# EAGLE design 220_nfc (EAGLE 9.6.2)
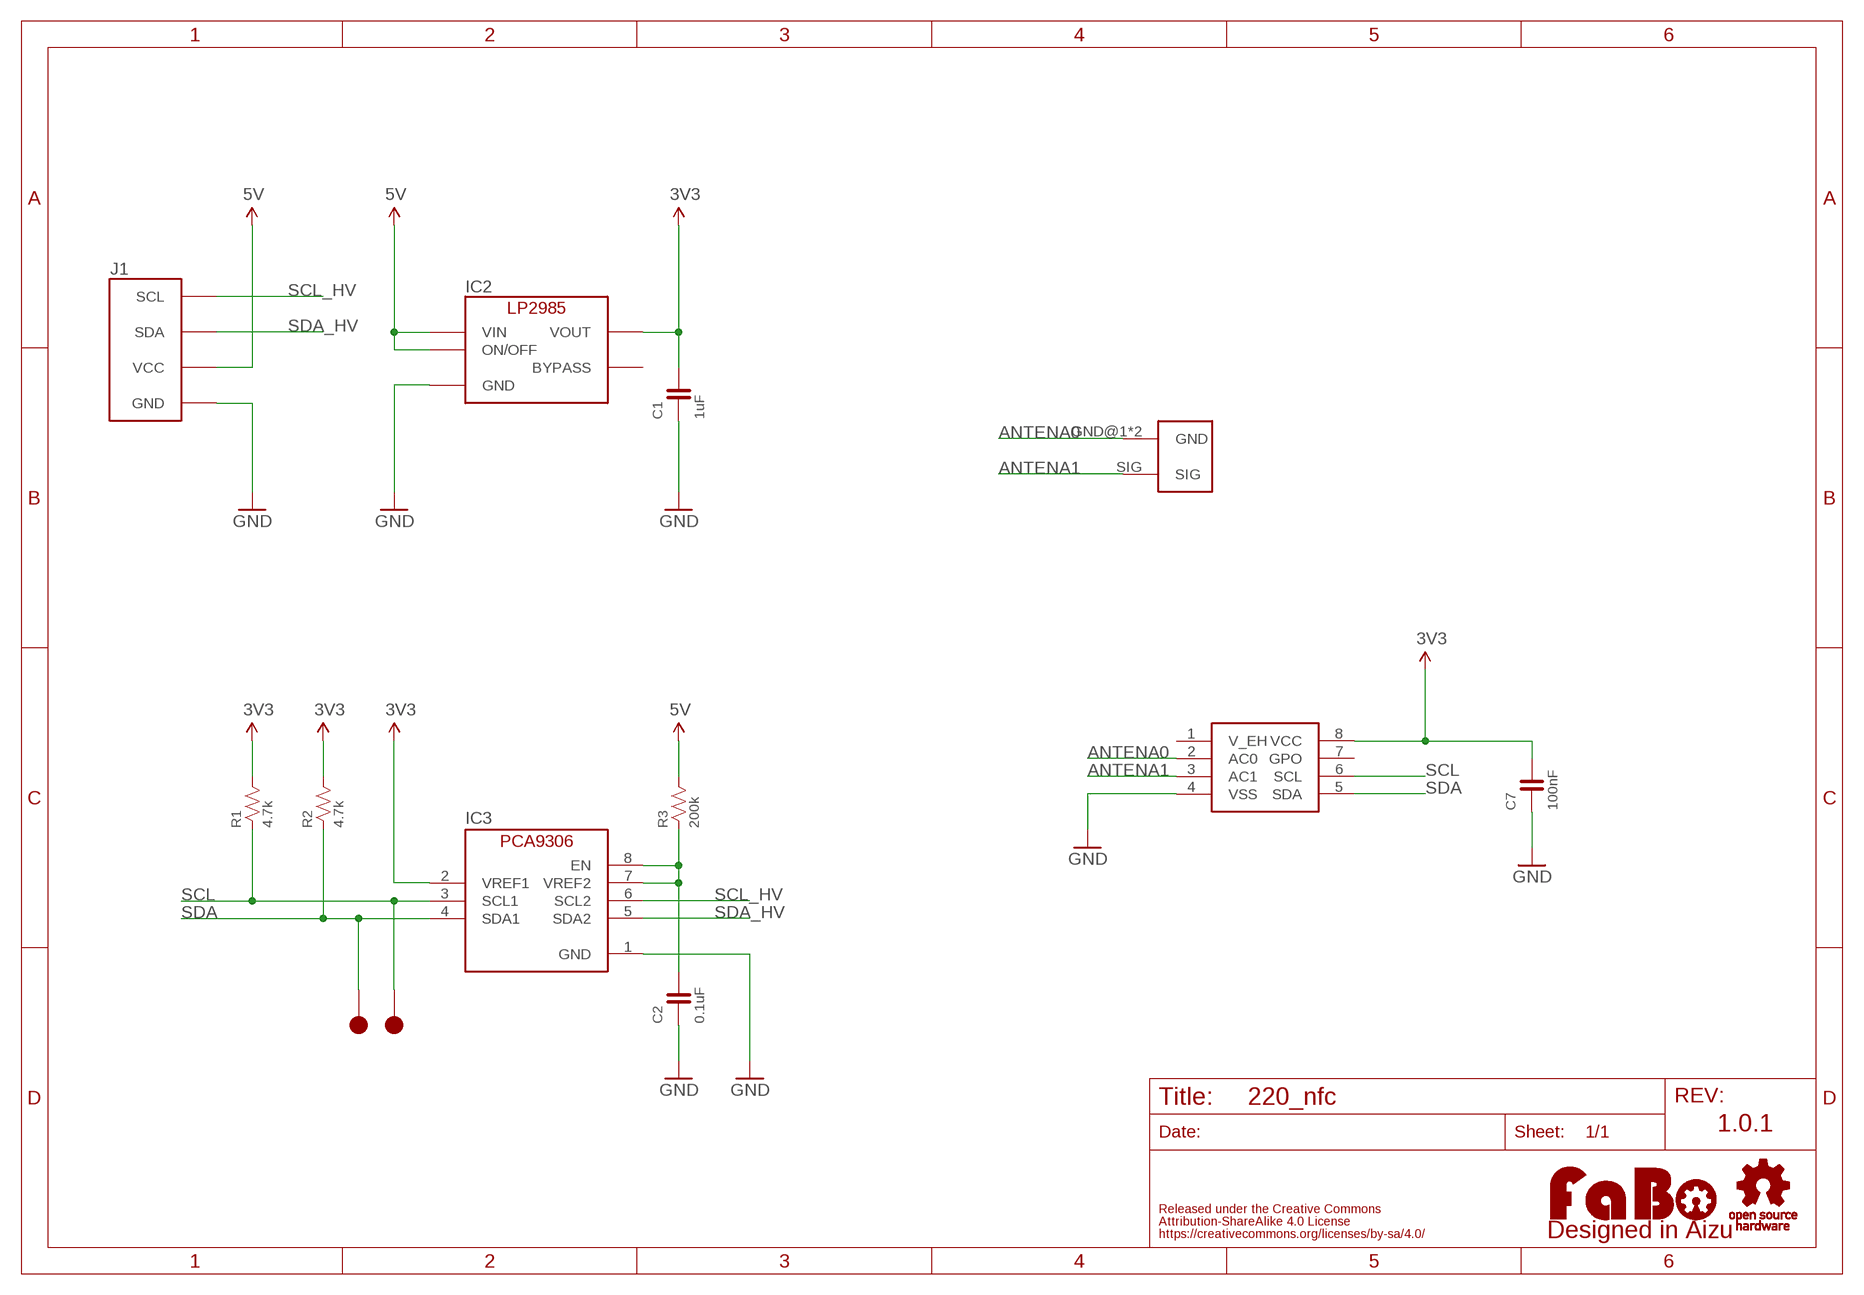
[diagram p0: schematic, sheet 1]

## Parts
C1  1uF  CAPACITOR-0603  [0603]
C2  0.1uF  CAPACITOR-0603  [0603]
C7  100nF  CAPACITOR-0603  [0603]
IC2  LP2985-33DBV  [SOT-23-5]
IC3  PCA9306GM  [XQFN8]
J1  FABO_BRICK_I2C  [FABO_BRICK_I2C]
LOGO1  LOGO_FABO-M  [LOGO_FABO_M]
R1  4.7k  RESISTOR-0603  [0603]
R2  4.7k  RESISTOR-0603  [0603]
R3  200k  RESISTOR-0603  [0603]
TP1  TP-15  [TP-15]
TP2  TP-15  [TP-15]
U$2  LOGO_OSHW-M_BOTTOM  [LOGO_OSHW_M_BOTTOM]
U$4  ST-ST25DV64K  [SO-8]
UF1  HIROSE-U.FL  [HIROSE-UF.L]

## Nets
3V3: C1.2 C7.2 IC2.5(VOUT) IC3.2(VREF1) R1.2 R2.2 U$4.8(VCC)
5V: IC2.1(VIN) IC2.3(ON/OFF) J1.VCC R3.2
ANTENA0: U$4.2(AC0) UF1.GND@1(GND) UF1.GND@2(GND)
ANTENA1: U$4.3(AC1) UF1.SIG
GND: C1.1 C2.1 C7.1 IC2.2(GND) IC3.1(GND) J1.GND U$4.4(VSS)
N$1: C2.2 IC3.7(VREF2) IC3.8(EN) R3.1
SCL: IC3.3(SCL1) R1.1 TP2.1 U$4.6(SCL)
SCL_HV: IC3.6(SCL2) J1.SCL
SDA: IC3.4(SDA1) R2.1 TP1.1 U$4.5(SDA)
SDA_HV: IC3.5(SDA2) J1.SDA
Unconnected: IC2.4(BYPASS) U$4.1(V_EH) U$4.7(GPO)

## Notes on the sheet
- 1.0.1

## Library data of the parts
C1 C2 C7 = FaBo-Capacitor:CAPACITOR: CAPACITOR
IC2 = FaBo-Supply:LP2985: LP2985
IC3 = FaBo-LevelTranslator:PCA9306
J1 = FaBo-Template:FABO_BRICK_I2C: FaBo Brick I2C
LOGO1 = component:LOGO_FABO
R1-R3 = FaBo-Resistors:RESISTOR: RESISTOR
TP1 TP2 = FaBo-Supply:TP
U$2 = FaBo-etc:LOGO_OSHW
U$4 = FaBo-Mems:ST-ST25DV64K
UF1 = FaBo-Connetor:HIROSE-U.FL

## Board
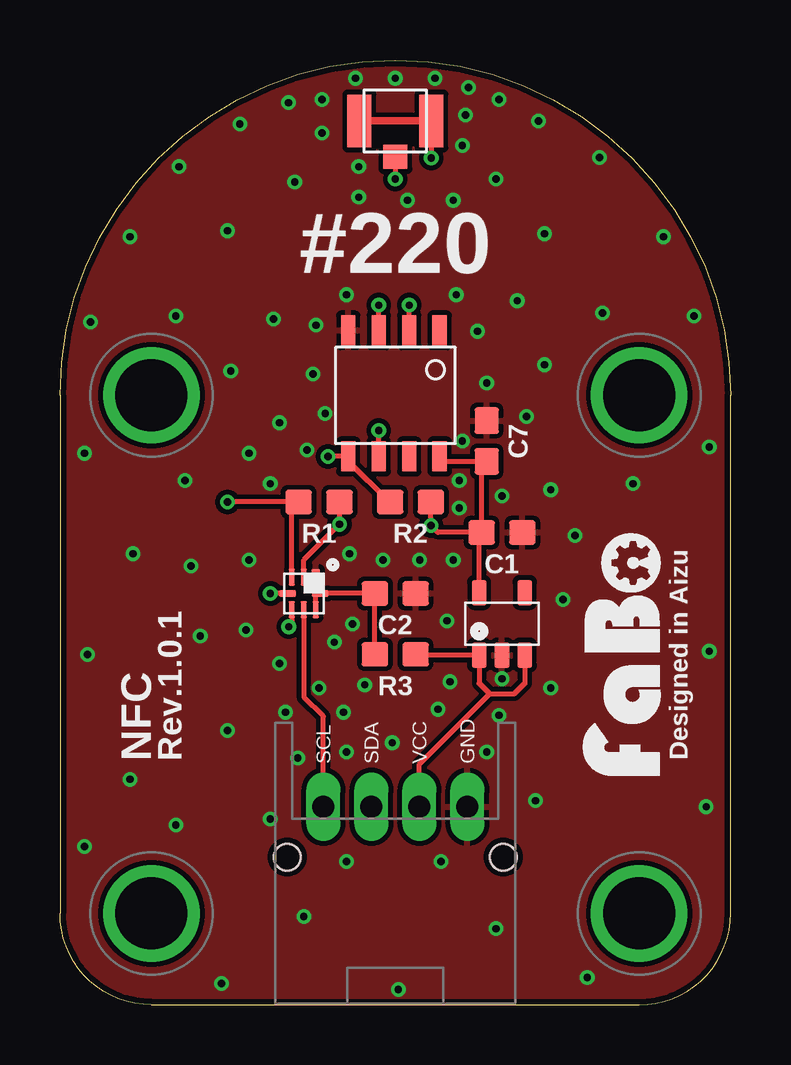
[diagram p1: board, top side]
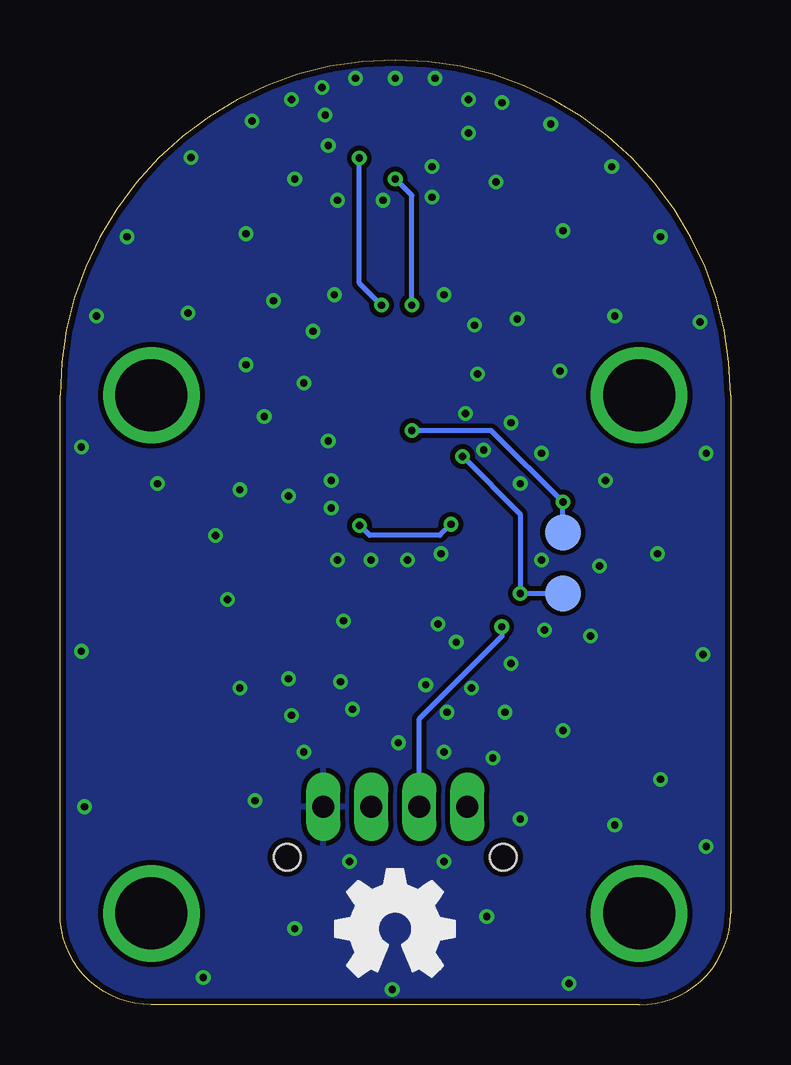
[diagram p2: board, bottom side, seen from below]

Size 27.94 x 39.37 mm. Coordinates in mm from the lower left corner, seen from the top.
Copper layers (1*16): Top 0.035mm / dielectric 1.6mm / Bottom 0.035mm
Design rules "PCBway": minimum track width 6mil, minimum drill 12mil, track to track 6mil, track to pad 6mil, pad to pad 6mil, via to via 6mil, smd to smd 6mil, copper to edge 10mil, drill to drill 10mil, minimum pad ring 10mil, minimum via ring 6mil, stop-mask expansion 2mil, vias tented up to drill 100mil, thermal gap 8mil

### Footprints (pad centres in the part's own frame; a part is rotated, then mirrored left to right if it is on the bottom)
0603 = smd 1.1 x 1: 1 -0.85,0; 2 0.85,0
SOT-23-5 = smd 0.6 x 1.05: 1 -0.95,-1.3; 2 0,-1.3; 3 0.95,-1.3; 4 0.95,1.3; 5 -0.95,1.3
XQFN8 = smd 0.7 x 0.35: 1 -0.675,0.5 | smd 0.7 x 0.25: 2 -0.675,0; 3 -0.675,-0.5; 5 0.675,-0.5; 6 0.675,0; 7 0.675,0.5 | smd 0.25 x 0.7: 4 0,-0.675; 8 0,0.675
FABO_BRICK_I2C = drill 0.9 pad 1.422 long: GND 3,-10.795; SCL -3,-10.795; SDA -1,-10.795; VCC 1,-10.795 | drill 3 pad 3.81: P$1 -10.16,6.35; P$2 10.16,6.35; P$3 -10.16,-15.24; P$4 10.16,-15.24 | hole 1.1: -4.5,-12.895; 4.5,-12.895
TP-15 = smd 1.5 x 1.5: 1 0,0
SO-8 = smd 0.6 x 1.25: 1 -1.85,-2.7; 2 -0.58,-2.7; 3 0.69,-2.7; 4 1.96,-2.7; 5 1.96,2.55; 6 0.69,2.55; 7 -0.58,2.55; 8 -1.85,2.55
HIROSE-UF.L = smd 1 x 2.2: GND@1 -1.5,0; GND@2 1.5,0 | smd 1 x 1: SIG 0,-1.5

### Placement (x,y rotation side)
C1  18.41,19.68 180 top
C2  13.97,17.14 180 top
C7  17.78,23.5 270 top
IC2  18.41,15.88 0 top
IC3  10.16,17.14 270 top
J1  13.97,19.05 0 top
LOGO1  25.4,14.61 90 top
R1  10.79,20.95 0 top
R2  14.61,20.95 0 top
R3  13.97,14.61 0 top
TP1  6.99,17.14 0 bottom
TP2  6.99,19.68 0 bottom
U$2  13.97,3.17 0 top
U$4  13.97,25.4 180 top
UF1  13.97,36.83 0 top

### Tracks (layer width: path | path; a pad name or v marks a point on that pad's centre or on a via)
3V3  (via drill 0.3)
  Top 0.203: IC2.5 17.46,19.59 C1.2 | C1.2 17.57,22.43 C7.2 16.02,22.64 U$4.8 | R2.2 v15.46,19.98 15.75,19.68 C1.2 | IC3.2 10.16,18.54 v11.64,20.03 R1.2
  Bottom 0.203: v15.46,19.98 15.04,19.56 12.11,19.56 v11.64,20.03
5V
  Top 0.203: IC2.3 19.36,13.4 18.92,12.95 17.91,12.95 | 17.91,12.95 17.46,13.4 IC2.1 14.85,14.57 R3.2 | J1.VCC 14.97,10.02 17.91,12.95
ANTENA0  (via drill 0.3)
  Top 0.203: U$4.2 v14.55,29.16 | UF1.GND@2 v15.47,35.28
  Top 0.305: UF1.GND@1 UF1.GND@2
  Bottom 0.203: v14.55,29.16 15.47,30.07 v15.47,35.28
ANTENA1  (via drill 0.3)
  Top 0.203: U$4.3 v13.28,29.16 | UF1.SIG v13.97,34.42
  Bottom 0.203: v13.28,29.16 13.28,33.73 v13.97,34.42
GND  (via drill 0.3)
  other vias: 18.41,13.59 10.79,13.21 11.81,12.19 10.29,23.11 8.76,21.72 11.05,24.64 9.14,24.26 7.87,22.99 7.87,18.54 12.06,18.8 13.46,18.54 14.99,18.54 16.64,21.84 16.64,20.7 18.41,21.21 16.38,18.54 16.76,23.5 17.78,25.91 19.43,24.51 11.94,29.59 10.67,28.32 10.54,26.29 17.4,28.07 16.51,29.59 12.45,33.66 14.48,33.53 16.38,33.53 12.45,34.92 10.92,36.32 10.92,37.72 12.32,38.61 13.97,38.61 15.62,38.61 17.02,38.23 16.89,37.08 16.76,35.81 9.78,34.29 9.53,37.59 18.16,34.42 18.29,37.72 19.94,36.83 7.49,36.7 4.95,34.92 22.48,35.31 6.99,32.26 20.19,32.13 25.15,32 2.92,32 1.27,28.45 4.83,28.7 8.89,28.57 26.42,28.7 22.61,28.83 19.05,29.34 7.11,26.42 20.19,26.67 27.05,23.24 1.02,22.99 21.46,19.56 20.45,21.46 20.95,16.89 20.45,13.21 16.26,13.46 16.13,16 12.19,15.88 11.43,15.11 9.14,14.22 7.75,15.62 5.46,18.29 5.21,21.84 23.88,21.72 5.84,15.37 9.4,12.19 12.7,13.34 15.75,12.32 13.84,10.92 11.94,10.54 9.91,10.29 18.29,12.06 17.78,10.54 19.81,8.51 26.92,8.26 27.05,14.73 1.14,14.61 1.02,6.6 8.76,7.75 4.83,7.49 6.99,11.43 3.05,18.8 2.92,9.4 21.97,1.14 6.73,0.89 11.94,5.97 15.88,5.97 18.16,3.17 14.1,0.64 10.16,3.68
  pour Bottom (isolate 0.203): 0,0 28,0 28,39.37 0,39.37
  pour Top (isolate 0.203): 0,0 28,0 28,39.37 0,39.37
N$1
  Top 0.203: R3.1 C2.2 IC3.8 10.66,17.14 IC3.7
SCL  (via drill 0.3)
  Top 0.203: IC3.3 9.66,20.67 R1.1 v6.99,20.95 | U$4.6 v13.28,23.93
  Bottom 0.203: v13.28,23.93 9.96,23.93 v6.99,20.95 TP2.1
SCL_HV
  Top 0.203: IC3.6 10.16,12.83 10.97,12.02 J1.SCL
SDA  (via drill 0.3)
  Top 0.203: IC3.4 v8.76,17.14 | R2.1 13.72,20.95 12.01,22.66 U$4.5 v11.17,22.85
  Bottom 0.203: v11.17,22.85 8.76,20.45 v8.76,17.14 TP1.1
SDA_HV  (via drill 0.3)
  Top 0.203: IC3.5 9.66,15.88 v9.53,15.76
  Bottom 0.203: v9.53,15.76 9.53,15.36 12.97,11.92 J1.SDA

### Text on the board
tPlace: #220 | Designed in Aizu | NFC | Rev.1.0.1